# Altium schematic sheet 01_Schematic.SchDoc
size A4; Date: 12/04/2023; CheckedBy: Yen Doo; DrawnBy: Hnit; DocumentNumber: 01; Revision: 01; SheetNumber: 1; SheetTotal: 1; Time: 00:00:00
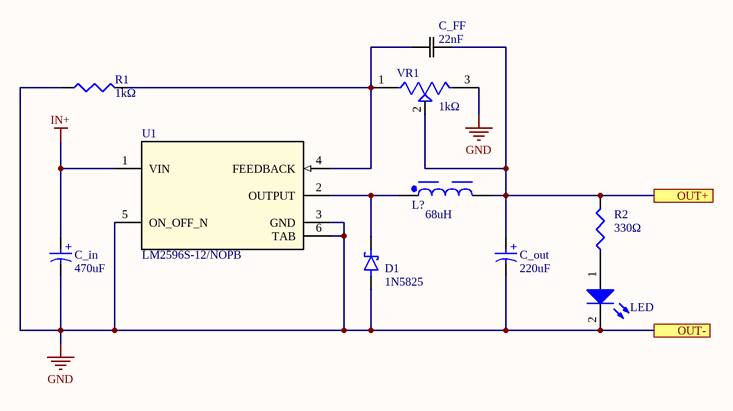
[diagram p0: 01_Schematic.SchDoc]

## Parts
330Ω  Ω  [WRIS-PSMB_0603_L1.6W0.8H0.3]  (value not drawn)
C_FF  (no value)  [CAPC17595_87N_KEM_0603]
C_in  ?µF  [WCAP-AS5H_D8H10.5]  (value not drawn)
C_out  ?µF  [WCAP-AS5H_D8H10.5]  (value not drawn)
D1  (no value)  [SODFL4725X110N]
L?  ?uH, ?A  [WE-PD_1510]  (value not drawn)
LED  Color ? , 3.2V, 140°  [WL-SMCW_0603_150060xx75020]  (value not drawn)
R1  Ω  [WRIS-PSMB_0603_L1.6W0.8H0.3]  (value not drawn)
U1  LM2596S-12/NOPB  [KTT0005B]
VR1  (no value)  [TRIM_3296W]

## Ports
OUT+, OUT-

## Nets
GND: C_in.2(N) C_out.2(N) D1.A LED.2(K) R1.1 U1.3(GND) U1.5(ON_OFF_N) U1.6(TAB) VR1.3(CW) ; port OUT-
IN+: C_in.1(P) U1.1(VIN)
OUT+: 330Ω.2 C_FF.2 C_out.1(P) L?.2 VR1.2(WIPER) ; port OUT+
Net330Ω_1: 330Ω.1 LED.1(A)
NetC_FF_1: C_FF.1 R1.2 U1.4(FEEDBACK) VR1.1(CCW)
NetD1_C: D1.C(K) L?.1 U1.2(OUTPUT)

## Notes on the sheet
- (near C_FF) 22nF
- (near R1) 1kΩ
- (near VR1) 1kΩ
- (near L?) 68uH
- (near 330Ω) R2
- (near C_in) 470uF
- (near D1) 1N5825
- (near C_out) 220uF
- Title
- Size
- Number
- Revision
- Date
- Draw by:
- A4
- Check by:
- Time
- File:
- (in symbol Capacitor_Alumanium_SMD) +

## Library data of the parts
330Ω R1 = Resistor_SMD: WRIS-PSMC Metal Plate Resistor, SMT, size 2512, 2W, 5mΩ, +/-1%; Manufacturer Part Number: 580070763005; Manufacturer: Wurth Elektronik; Case/Size Code: 2512; Rated Current: 20A; Technical Reference: MC2512R005F201KAATE0000; Temperature Coefficient of Resistance: +/-100ppm/°C; Category: Metal Plate Resistors; Match Code: WRIS-PSMC; ComponentLink1Description: Website Link; ComponentLink1URL: https://www.we-online.com/redexpert/article/580070763005?ad; ComponentLink2Description: Datasheet Link; ComponentLink2URL: https://www.we-online.com/redexpert/spec/580070763005?ad; Mount: Surface Mount; Operating Temperature Max: 155°C; Operating Temperature Min: -55°C; Packaging: Tape and Reel; Length: 6.3mm; Width: 3.1mm; Height: 0.51mm; Rated Power: 2W; Resistance Tolerance: +/-1%
  R1: Resistance: 5mΩ
C_FF = Capacitor_SMD: No Description Available; Mfr_Name: Kemet; Manufacturer_Part_Number: C1206C104K5RACTU; Copyright: Copyright (C) 2023 Ultra Librarian. All rights reserved.; RefDes: RefDes; Type: DEV
C_in C_out = Capacitor_Alumanium_SMD: WCAP-AS5H Aluminum Electrolytic Capacitor, V-Chip, D10 x H10.5mm, 330µF, 50V; Manufacturer Part Number: 865230657014; Manufacturer: Wurth Elektronik; Capacitance Tolerance: +/-20%; Dissipation Factor: 12%; Endurance: 5000h; Leakage Current: 165µA; Ripple Current: 900mA; Technical Reference: ASEF105331M050DVCTEE000; Category: Aluminum Electrolytic Capacitors; Match Code: WCAP-AS5H; ComponentLink1Description: Website Link; ComponentLink1URL: https://www.we-online.com/redexpert/article/865230657014?ad; ComponentLink2Description: Datasheet Link; ComponentLink2URL: https://www.we-online.com/redexpert/spec/865230657014?ad; Mount: Surface Mount; Operating Temperature Max: 105°C; Operating Temperature Min: -55°C; Packaging: Tape and Reel; Height: 10.5mm; Diameter: 10mm; Capacitance: 330µF; Rated Voltage (DC): 50V
D1 = Diode Schottky: Diode Schottky ?V ?A Surface Mount SMC; MP: MBRS320T3G; MF: ON Semiconductor; Package: DO-214 ON Semiconductor; Availability: Good; Arrow_Electronics-Purchase-URL: https://snapeda.com/shop?store=Arrow+Electronics&id=432205; SnapEDA_Link: https://www.snapeda.com/parts/MBRS320T3G/ON%20Semiconductor/view-part/432205/?ref=snap; DigiKey-Purchase-URL: https://snapeda.com/shop?store=DigiKey&id=432205; Mouser-Purchase-URL: https://snapeda.com/shop?store=Mouser&id=432205; Value: *; Price: None
L? = Inductor_SMD: WE-PD SMT Power Inductor, size ?, ?uH, ?A, ?Ohm; Manufacturer Part Number: 7447709152; Manufacturer: Wurth Elektronik; Case/Size Code: 1210; DC Resistance: 1800mOhm; DC Resistance Max: 2300mOhm; Inductance: 1500uH; Rated Current: 0.8A; Self Resonant Frequency: 0.9MHz; Type: Standard; Category: Power Inductors; Match Code: WE-PD; ComponentLink1Description: Website Link; ComponentLink1URL: https://www.we-online.com/redexpert/article/7447709152?ad; ComponentLink2Description: Datasheet Link; ComponentLink2URL: https://www.we-online.com/redexpert/spec/7447709152?ad; Mount: Surface Mount; Operating Temperature Max: 125°C; Operating Temperature Min: -40°C; Packaging: Tape and Reel; Length: 12mm; Width: 12mm; Height: 10mm; Saturation Current: 0.8A
LED = LED_smd: WL-SMCW Mono-color Chip LED Waterclear, size ?, color ?, 3.2V, 140°; Manufacturer Part Number: 150060BS75003; Manufacturer: Wurth Elektronik; Case/Size Code: 0603; Chip Technology: InGaN; Dominant Wavelength: 470nm; Emitting Color: Blue; Luminous Intensity: 350mcd; Peak Wavelength: 465nm; Category: Signal LEDs; Match Code: WL-SMCW; ComponentLink1Description: Website Link; ComponentLink1URL: https://www.we-online.com/redexpert/article/150060BS75003?ad; ComponentLink2Description: Datasheet Link; ComponentLink2URL: https://www.we-online.com/redexpert/spec/150060BS75003?ad; Mount: Surface Mount; Operating Temperature Max: 100°C; Operating Temperature Min: -40°C; Packaging: Tape and Reel; Length: 1.6mm; Width: 0.8mm; Height: 0.7mm; Forward Voltage: 3.2V; Viewing Angle: 140°
U1 = LM2596S-12/NOPB: No Description Available; Mfr_Name: Texas Instruments; PartNumber: LM2596SX-ADJ/NOPB; Alternate_PartNumber: LM2596S-ADJ/NOPB; CompType: IC; Type: DEV; RefDes: RefDes; Copyright: Copyright (C) 2023 Ultra Librarian. All rights reserved.; Manufacturer_Part_Number: LM2596S-12/NOPB; PackageReference: KTT0005B; MountType: SMT; RoHS: Y; Manufacturer: Texas Instruments
VR1 = Variable_Resistor: ? Ohms 0.75W, 3/4W PC Pins Panel Mount, Through Hole Trimmer Potentiometer Cermet 15.0 Turn Side Adjustment; MF: Bourns; MP: 3006P-1-202; Check_prices: https://www.snapeda.com/parts/3006P-1-202/Bourns/view-part/?ref=eda; SnapEDA_Link: https://www.snapeda.com/parts/3006P-1-202/Bourns/view-part/?ref=snap; Price: None; Value: *; Availability: In Stock; Package: NON-STANDARD-3 Bourns; Purchase-URL: https://pricing.snapeda.com/search/part/3006P-1-202/?ref=eda